# EAGLE design EmbluLjós (EAGLE 6.5.0)
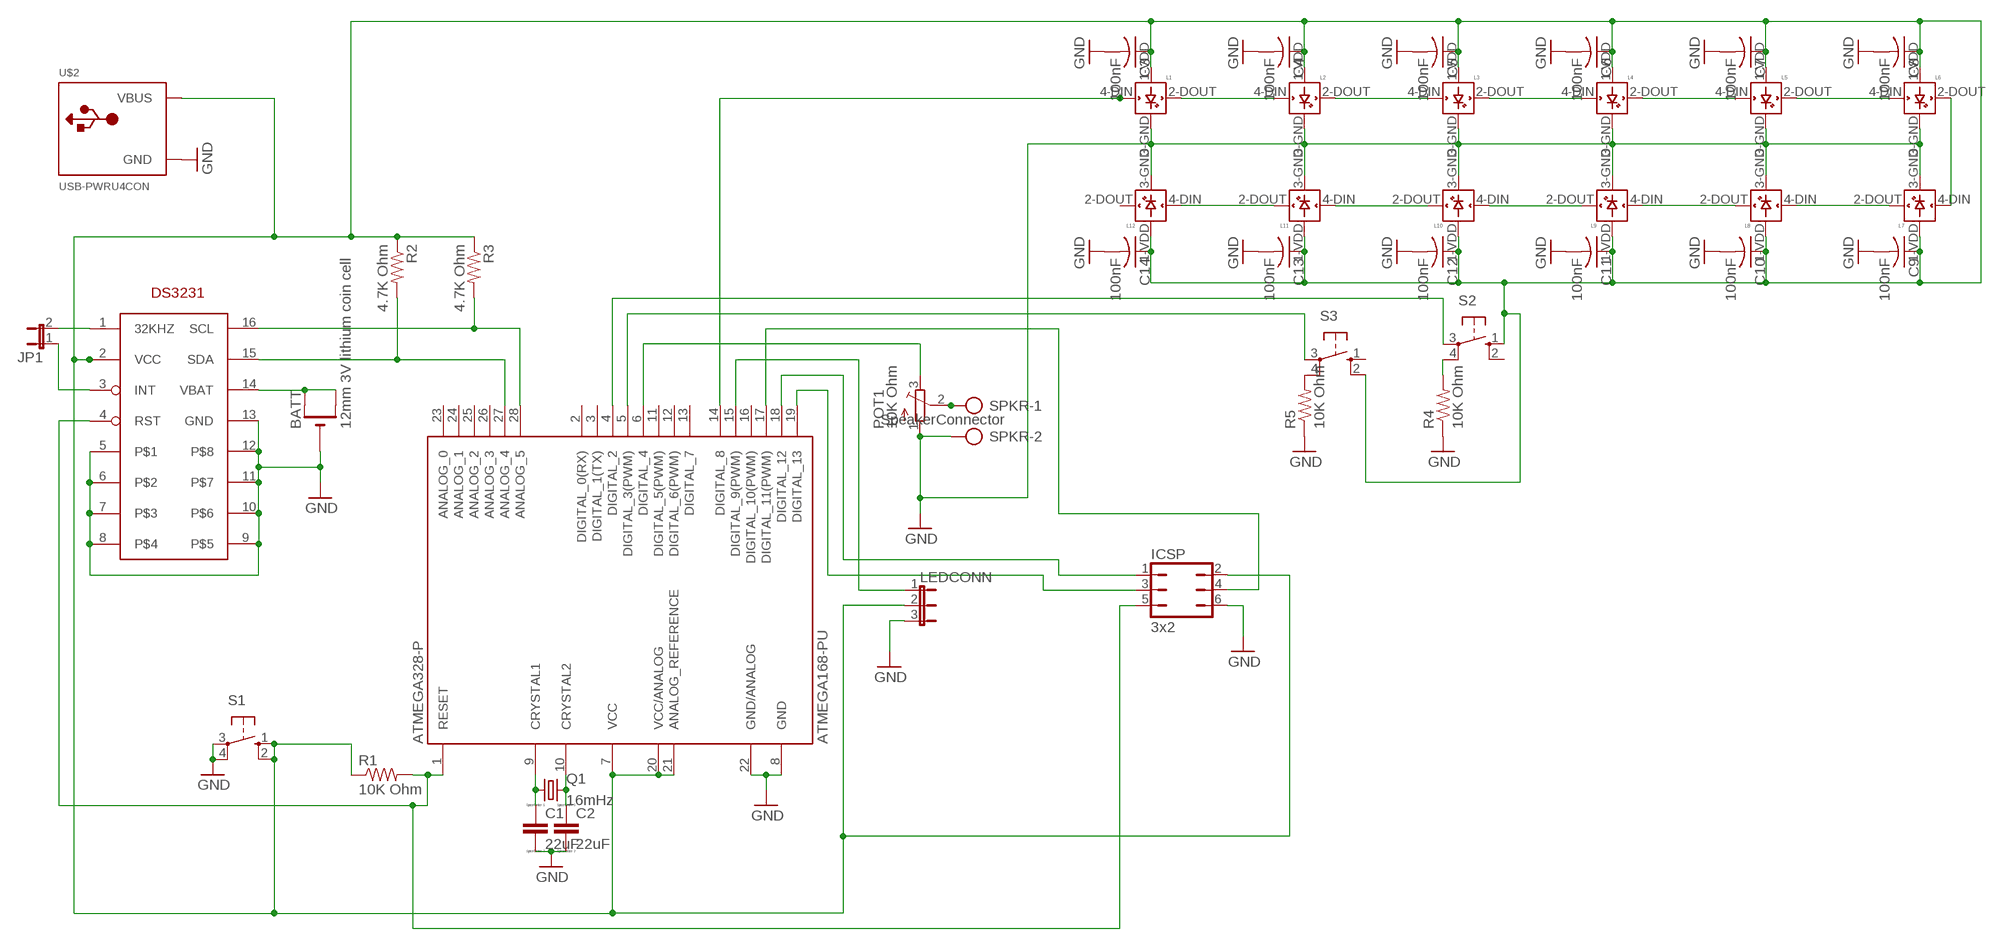
[diagram p0: schematic, sheet 1]

## Parts
ATMEGA328-P  ATMEGA168-PU  [DIL28-3]
BATT  12mm 3V lithium coin cell  CR1220THM  [CR1220-THM]
C1  22uF  C  [C0805]
C2  22uF  C  [C0805]
C3  100nF  C-USC0805  [C0805]
C4  100nF  C-USC0805  [C0805]
C5  100nF  C-USC0805  [C0805]
C6  100nF  C-USC0805  [C0805]
C7  100nF  C-USC0805  [C0805]
C8  100nF  C-USC0805  [C0805]
C9  100nF  C-USC0805  [C0805]
C10  100nF  C-USC0805  [C0805]
C11  100nF  C-USC0805  [C0805]
C12  100nF  C-USC0805  [C0805]
C13  100nF  C-USC0805  [C0805]
C14  100nF  C-USC0805  [C0805]
ICSP  3x2  JP3Q  [JP3Q]
JP1  JP1E  [JP1]
L1  WS2812B  [WS2812B]
L2  WS2812B  [WS2812B]
L3  WS2812B  [WS2812B]
L4  WS2812B  [WS2812B]
L5  WS2812B  [WS2812B]
L6  WS2812B  [WS2812B]
L7  WS2812B  [WS2812B]
L8  WS2812B  [WS2812B]
L9  WS2812B  [WS2812B]
L10  WS2812B  [WS2812B]
L11  WS2812B  [WS2812B]
L12  WS2812B  [WS2812B]
LEDCONN  JP2E  [JP2]
POT1  10K Ohm  TRIMPOTTC33X  [TC33X]
Q1  16mHz  CRYSTALHC49S  [HC49/S]
R1  10K Ohm  R-US_R0805  [R0805]
R2  4.7K Ohm  R-US_R0805  [R0805]
R3  4.7K Ohm  R-US_R0805  [R0805]
R4  10K Ohm  R-US_R0805  [R0805]
R5  10K Ohm  R-US_R0805  [R0805]
S1  10-XX  [B3F-10XX]
S2  10-XX  [B3F-10XX]
S3  10-XX  [B3F-10XX]
SPKR  SpeakerConnector  AK500/2-H  [AK500/2-H]
U$1  DS3231  [SO16]
U$2  USB-PWRU4CON  [USB-MINIB-THM-PWRONLY]

## Nets
GND: ATMEGA328-P.8(GND) ATMEGA328-P.22(GND/ANALOG) BATT.- C1.2 C2.2 C3.2 C4.2 C5.2 C6.2 C7.2 C8.2 C9.2 C10.2 C11.2 C12.2 C13.2 C14.2 ICSP.6 L1.3-GND(GND) L2.3-GND(GND) L3.3-GND(GND) L4.3-GND(GND) L5.3-GND(GND) L6.3-GND(GND) L7.3-GND(GND) L8.3-GND(GND) L9.3-GND(GND) L10.3-GND(GND) L11.3-GND(GND) L12.3-GND(GND) LEDCONN.3 POT1.1(A) R4.1 R5.1 S1.3(P) S1.4(P1) SPKR.2 U$1.5 U$1.6 U$1.7 U$1.8 U$1.9 U$1.10 U$1.11 U$1.12 U$1.13(GND) U$2.GND
N$1: ATMEGA328-P.1(RESET) ICSP.5 R1.2 U$1.4(RST)
N$2: ATMEGA328-P.18(DIGITAL_12) ICSP.1
N$3: BATT.+1(+) BATT.+2(+1) U$1.14(VBAT)
N$4: POT1.2(S) SPKR.1
N$5: ATMEGA328-P.6(DIGITAL_4) POT1.3(E)
N$6: ATMEGA328-P.28(ANALOG_5) R3.2 U$1.16(SCL)
N$7: ATMEGA328-P.27(ANALOG_4) R2.2 U$1.15(SDA)
N$8: ATMEGA328-P.10(CRYSTAL2) C2.1 Q1.2
N$9: ATMEGA328-P.9(CRYSTAL1) C1.1 Q1.1
N$10: ATMEGA328-P.15(DIGITAL_9(PWM)) LEDCONN.1
N$11: JP1.2 U$1.1(32KHZ)
N$12: JP1.1 U$1.3(INT)
N$13: L1.2-DOUT(DOUT) L2.4-DIN(DIN)
N$14: L2.2-DOUT(DOUT) L3.4-DIN(DIN)
N$15: L3.2-DOUT(DOUT) L4.4-DIN(DIN)
N$16: L4.2-DOUT(DOUT) L5.4-DIN(DIN)
N$17: L5.2-DOUT(DOUT) L6.4-DIN(DIN)
N$18: ATMEGA328-P.19(DIGITAL_13) ICSP.3
N$19: L6.2-DOUT(DOUT) L7.4-DIN(DIN)
N$20: L7.2-DOUT(DOUT) L8.4-DIN(DIN)
N$21: L8.2-DOUT(DOUT) L9.4-DIN(DIN)
N$22: L10.2-DOUT(DOUT) L11.4-DIN(DIN)
N$23: L11.2-DOUT(DOUT) L12.4-DIN(DIN)
N$24: L9.2-DOUT(DOUT) L10.4-DIN(DIN)
N$25: ATMEGA328-P.4(DIGITAL_2) S2.3(P)
N$26: R4.2 S2.4(P1)
N$27: ATMEGA328-P.7(VCC) ATMEGA328-P.20(VCC/ANALOG) ATMEGA328-P.21(ANALOG_REFERENCE) C3.1 C4.1 C5.1 C6.1 C7.1 C8.1 C9.1 C10.1 C11.1 C12.1 C13.1 C14.1 ICSP.2 L1.1-VDD(VDD) L2.1-VDD(VDD) L3.1-VDD(VDD) L4.1-VDD(VDD) L5.1-VDD(VDD) L6.1-VDD(VDD) L7.1-VDD(VDD) L8.1-VDD(VDD) L9.1-VDD(VDD) L10.1-VDD(VDD) L11.1-VDD(VDD) L12.1-VDD(VDD) LEDCONN.2 R1.1 R2.1 R3.1 S1.1(S) S1.2(S1) S2.1(S) S3.2(S1) U$1.2(VCC) U$2.VBUS
N$28: R5.2 S3.4(P1)
N$29: ATMEGA328-P.5(DIGITAL_3(PWM)) S3.3(P)
N$38: ATMEGA328-P.14(DIGITAL_8) L1.4-DIN(DIN)
N$39: ATMEGA328-P.17(DIGITAL_11(PWM)) ICSP.4
Unconnected: ATMEGA328-P.2(DIGITAL_0(RX)) ATMEGA328-P.3(DIGITAL_1(TX)) ATMEGA328-P.11(DIGITAL_5(PWM)) ATMEGA328-P.12(DIGITAL_6(PWM)) ATMEGA328-P.13(DIGITAL_7) ATMEGA328-P.16(DIGITAL_10(PWM)) ATMEGA328-P.23(ANALOG_0) ATMEGA328-P.24(ANALOG_1) ATMEGA328-P.25(ANALOG_2) ATMEGA328-P.26(ANALOG_3) L12.2-DOUT(DOUT) S2.2(S1) S3.1(S)

## Library data of the parts
ATMEGA328-P = Arduino-AVR:ATMEGA168-PU
BATT = adafruit:CR1220: CR1216/CR1220/CR1225 12mm 3V lithium coin cell Great for battery packup. Both SMT and THM holders. Note the THM package has the ground pads on both sides of the PCB so that the masks are the same - this reduces the cost
C1 C2 = eagle-ltspice:C: CAPACITOR, European symbol; SPICEMODEL: NONE; SPICEPREFIX: C
C3-C14 = adafruit:C-US: CAPACITOR, American symbol
ICSP = jumper:JP3Q: JUMPER
JP1 = jumper:JP1E: JUMPER
L1-L12 = adafruit:WS2812B
LEDCONN = jumper:JP2E: JUMPER
POT1 = adafruit:TRIMPOT: SMT trimmer potentiometer part number TC33X http://www.ladyada.net/library/eagle
Q1 = crystal:CRYSTAL: CRYSTAL; OC_FARNELL: 1667008; OC_NEWARK: unknown
R1-R5 = rcl:R-US_: RESISTOR, American symbol
S1-S3 = switch-omron:10-XX: OMRON SWITCH; MPN: B3F-1000; OC_FARNELL: 176432; OC_NEWARK: 36M3542
SPKR = con-ptr500:AK500/2-H: CONNECTOR Aug. 2004 / PTR Meßtechnik: Die Bezeichnung der Serie AK505 wurde geändert. Es handelt sich hierbei um AK500 in horizontaler Ausführung.; OC_FARNELL: unknown; OC_NEWARK: unknown
U$1 = DS3231:DS3231
U$2 = adafruit:USB-PWR

## Board
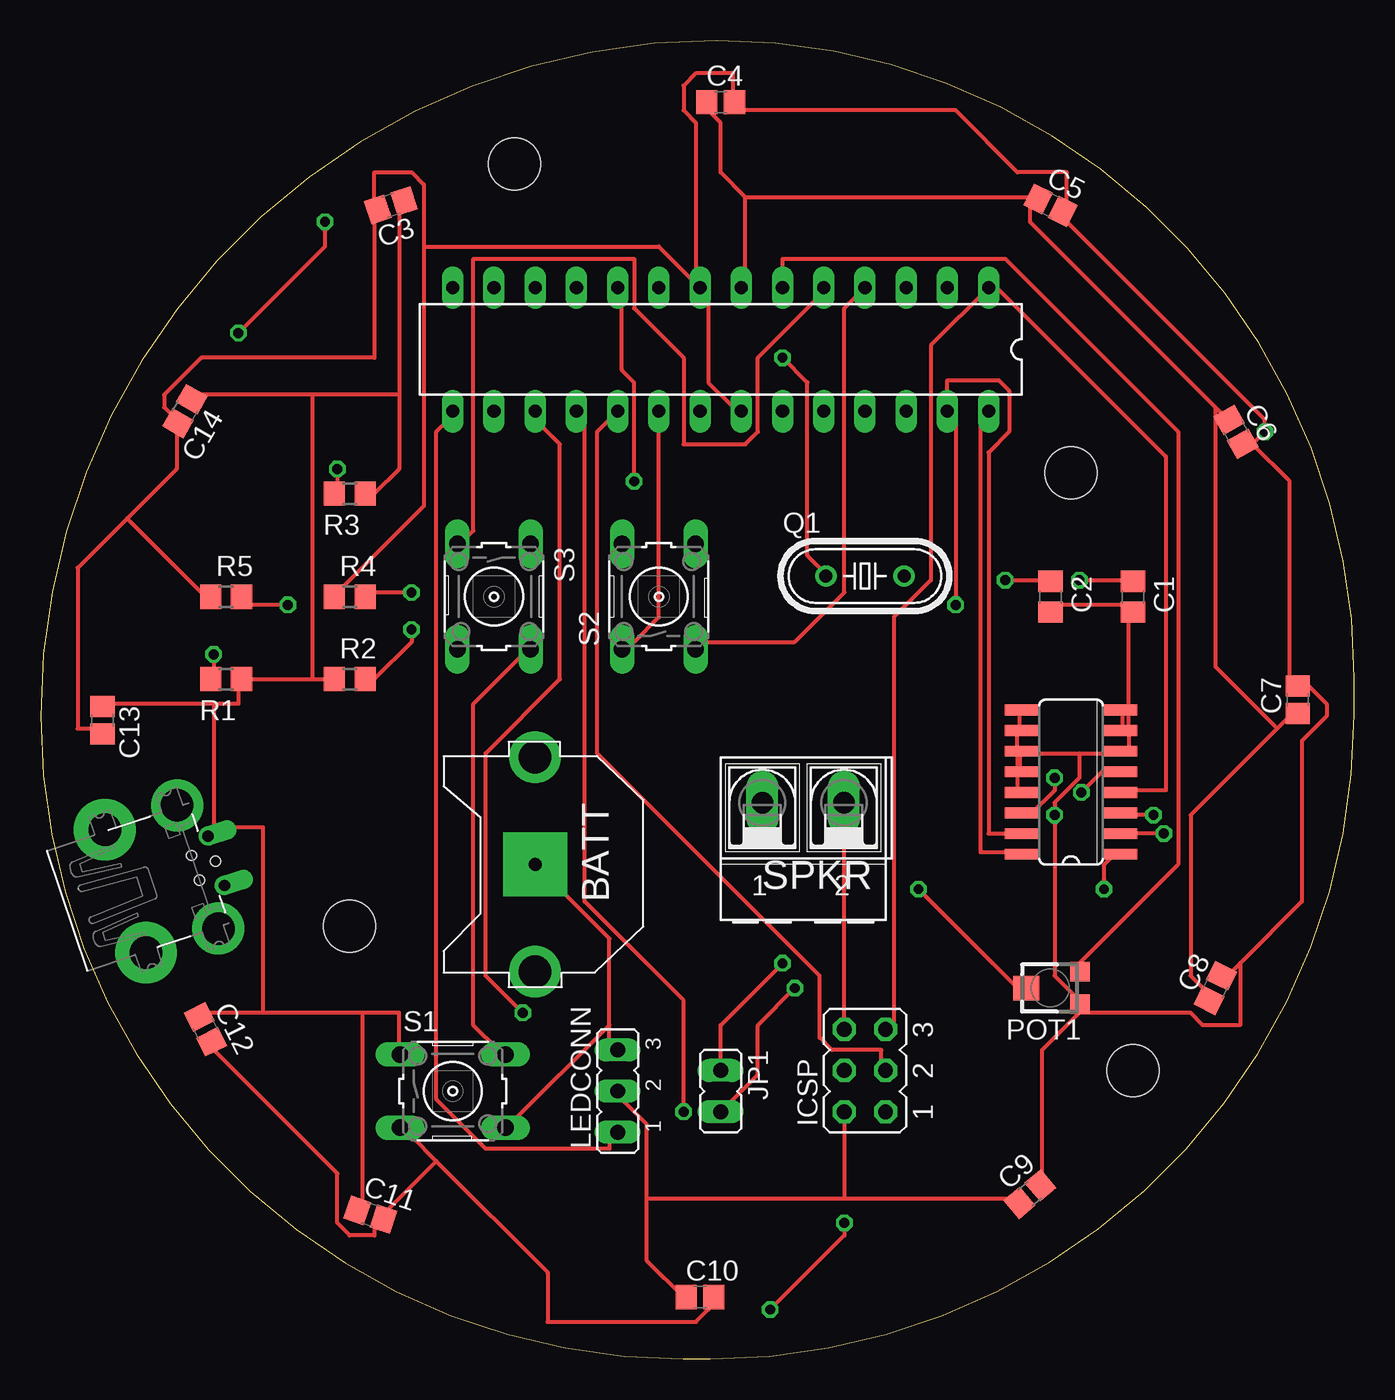
[diagram p1: board, top side]
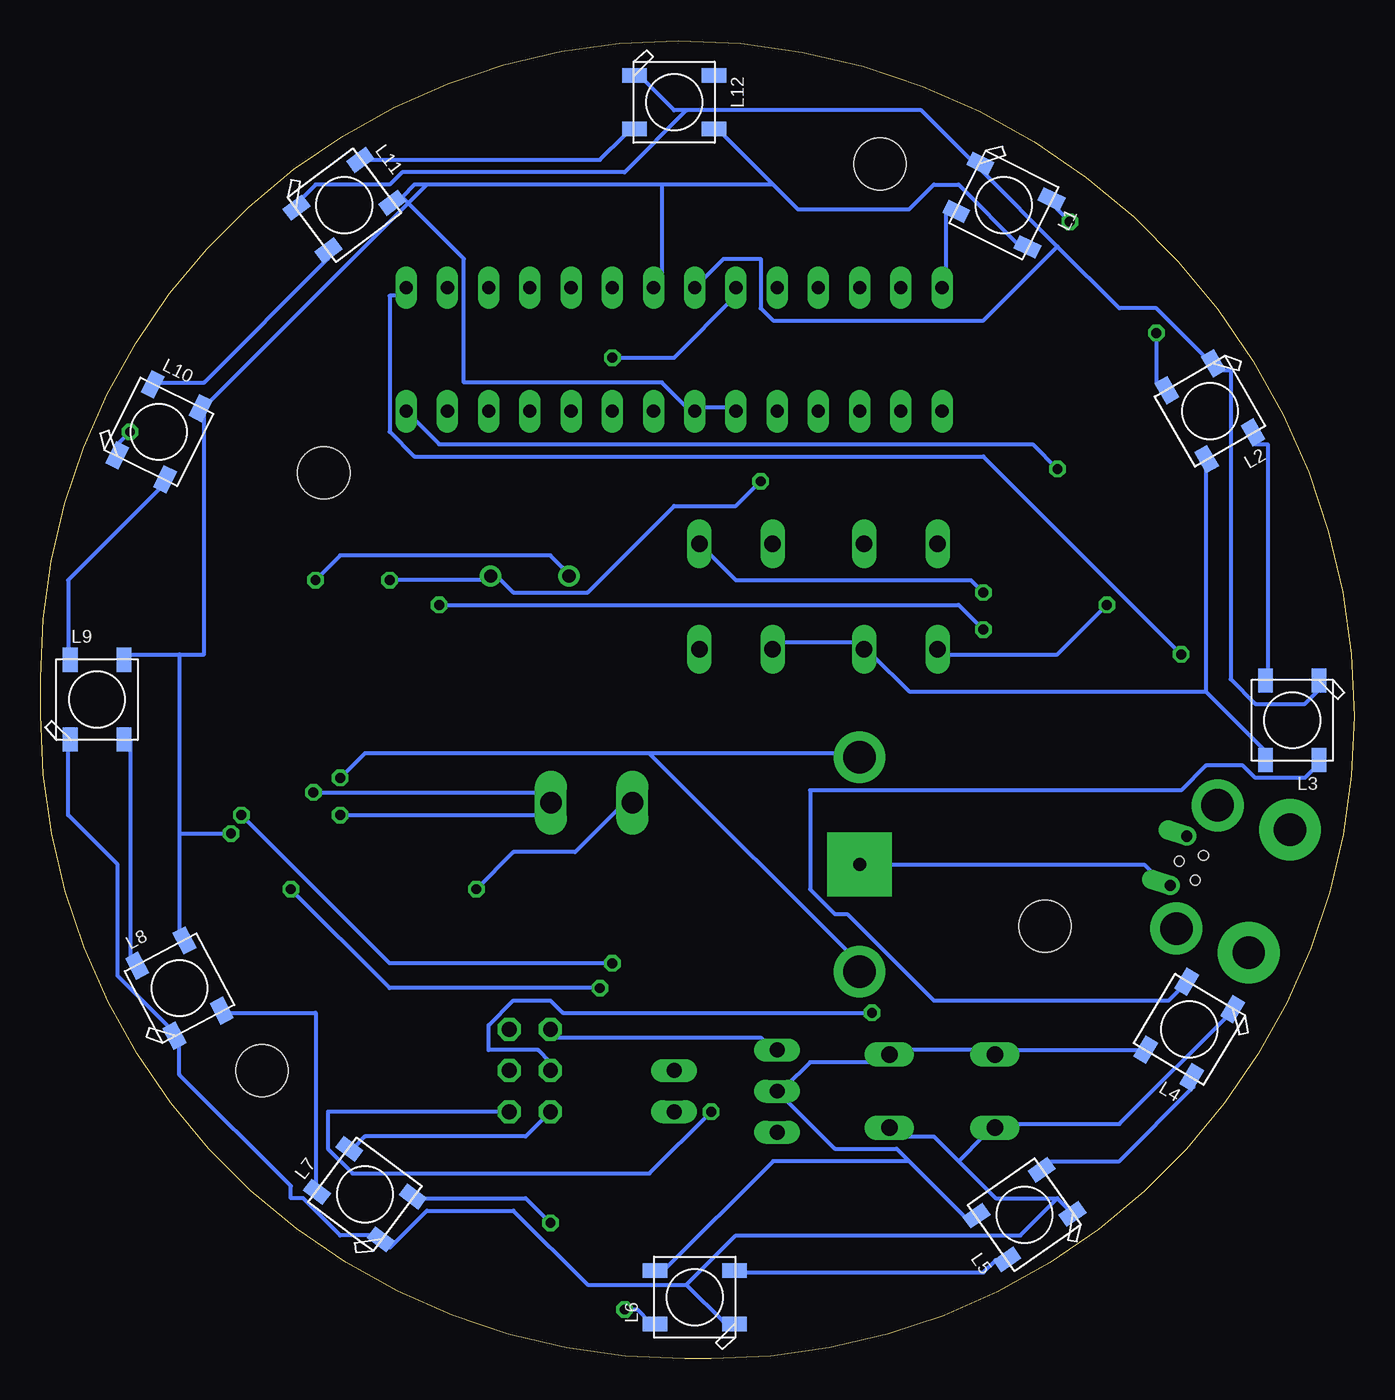
[diagram p2: board, bottom side, seen from below]

Size 80.95 x 81.27 mm. Coordinates in mm from the lower left corner, seen from the top.
Outline: 0,39.62 arc90 39.62,0 41.26,0 arc90 80.95,39.69 80.95,41.97 arc90 41.65,81.27 arc90 0,39.62
Copper layers (1*16): Top 0.035mm / dielectric 1.5mm / Bottom 0.035mm
Design rules "default": minimum track width 10mil, minimum drill 24mil, track to track 8mil, track to pad 8mil, pad to pad 8mil, via to via 8mil, smd to smd 8mil, copper to edge 40mil, drill to drill 8mil, minimum pad ring 10mil, minimum via ring 8mil, stop-mask expansion 4mil, vias tented up to drill 0mil, thermal gap 10mil
Holes 3.2 mm at 19.05,26.67 29.21,73.66 63.5,54.61 67.31,17.78

### Footprints (pad centres in the part's own frame; a part is rotated, then mirrored left to right if it is on the bottom)
DIL28-3 = drill 0.813 long: 1 -16.51,-3.81; 2 -13.97,-3.81; 3 -11.43,-3.81; 4 -8.89,-3.81; 5 -6.35,-3.81; 6 -3.81,-3.81; 7 -1.27,-3.81; 8 1.27,-3.81; 9 3.81,-3.81; 10 6.35,-3.81; 11 8.89,-3.81; 12 11.43,-3.81; 13 13.97,-3.81; 14 16.51,-3.81; 15 16.51,3.81; 16 13.97,3.81; 17 11.43,3.81; 18 8.89,3.81; 19 6.35,3.81; 20 3.81,3.81; 21 1.27,3.81; 22 -1.27,3.81; 23 -3.81,3.81; 24 -6.35,3.81; 25 -8.89,3.81; 26 -11.43,3.81; 27 -13.97,3.81; 28 -16.51,3.81
CR1220-THM = drill 2 pad 3.175: +1 -6.604,0; +2 6.604,0 | drill 0.8 pad 3.962 square: - 0,0
C0805 = smd 1.3 x 1.5: 1 -0.95,0; 2 0.95,0
C0805' = smd 1.3 x 1.5: 1 -0.85,0; 2 0.85,0
JP3Q = drill 0.914 octagon: 1 -2.54,-1.27; 2 -2.54,1.27; 3 0,-1.27; 4 0,1.27; 5 2.54,-1.27; 6 2.54,1.27
JP1 = drill 0.914 long: 1 0,-1.27; 2 0,1.27
WS2812B = smd 1.5 x 0.9: 1-VDD 2.45,-1.65; 2-DOUT 2.45,1.65; 3-GND -2.45,1.65; 4-DIN -2.45,-1.65
JP2 = drill 0.914 long: 1 -2.54,0; 2 0,0; 3 2.54,0
TC33X = smd 1.2 x 1.2: 1 -1,-1.825; 3 1,-1.825 | smd 1.5 x 1.6: 2 0,1.5
HC49/S = drill 0.813: 1 -2.413,0; 2 2.413,0
R0805 = smd 1.3 x 1.5: 1 -0.95,0; 2 0.95,0
B3F-10XX = drill 1.016 long: 1 -3.251,2.261; 2 3.251,2.261; 3 -3.251,-2.261; 4 3.251,-2.261
AK500/2-H = drill 1.321 long: 1 -2.515,0; 2 2.515,0
SO16 = smd 0.66 x 2.032: 1 -4.445,-3.073; 2 -3.175,-3.073; 3 -1.905,-3.073; 4 -0.635,-3.073; 5 0.635,-3.073; 6 1.905,-3.073; 7 3.175,-3.073; 8 4.445,-3.073; 9 4.445,3.073; 10 3.175,3.073; 11 1.905,3.073; 12 0.635,3.073; 13 -0.635,3.073; 14 -1.905,3.073; 15 -3.175,3.073; 16 -4.445,3.073
USB-MINIB-THM-PWRONLY = drill 0.7 offset: GND 1.6,4.72; VBUS -1.6,4.72 | drill 2 pad 3.81: GND1 -4,-1.18; GND4 4,-1.18 | drill 2 pad 3.2: GND2 -4,3.52; GND3 4,3.52 | hole 0.6: -0.8,3.37; 0.8,3.37; 0,4.67

### Placement (x,y rotation side)
ATMEGA328-P  41.91,62.23 180 top
BATT  30.48,30.48 90 top
C1  67.31,46.99 270 top
C2  62.23,46.99 270 top
C3  100nF  [C0805']  21.59,71.12 198.5 top
C4  100nF  [C0805']  41.91,77.47 0 top
C5  100nF  [C0805']  62.23,71.12 333.5 top
C6  100nF  [C0805']  73.66,57.15 299.7 top
C7  100nF  [C0805']  77.47,40.64 90 top
C8  100nF  [C0805']  72.39,22.86 63.5 top
C9  100nF  [C0805']  60.96,10.16 40 top
C10  100nF  [C0805']  40.64,3.81 0 top
C11  100nF  [C0805']  20.32,8.89 341.5 top
C12  100nF  [C0805']  10.16,20.32 296.5 top
C13  100nF  [C0805']  3.81,39.37 270 top
C14  100nF  [C0805']  8.89,58.42 240 top
ICSP  50.8,17.78 90 top
JP1  41.91,16.51 180 top
L1  21.59,71.12 333.5 bottom
L2  8.89,58.42 300 bottom
L3  3.81,39.37 270 bottom
L4  10.16,20.32 239.1 bottom
L5  20.32,8.89 215 bottom
L6  40.64,3.81 180 bottom
L7  60.96,10.16 143.2 bottom
L8  72.39,22.86 117.9 bottom
L9  77.47,40.64 90 bottom
L10  73.66,57.15 63.5 bottom
L11  62.23,71.12 36.8 bottom
L12  41.91,77.47 0 bottom
LEDCONN  35.56,16.51 90 top
POT1  62.23,22.86 90 top
Q1  50.8,48.26 0 top
R1  11.43,41.91 180 top
R2  19.05,41.91 0 top
R3  19.05,53.34 180 top
R4  19.05,46.99 0 top
R5  11.43,46.99 0 top
S1  25.4,16.51 0 top
S2  38.1,46.99 90 top
S3  27.94,46.99 270 top
SPKR  46.99,34.29 0 top
U$1  63.5,35.56 90 top
U$2  6.35,29.21 288.5 top

### Tracks (layer width: path | path; a pad name or v marks a point on that pad's centre or on a via)
GND  (via drill 0.61)
  Top 0.254: C12.2 10.67,19.05 18.29,11.43 18.29,8.38 19.05,7.62 20.57,7.62 20.57,8.38 C11.2 21.34,9.14 24.38,12.19 | 24.38,12.19 22.86,13.72 S1.3 | 24.38,12.19 31.24,5.33 31.24,2.29 40.39,2.29 41.15,3.05 41.15,3.81 C10.2 | 11.43,28.96 U$2.GND | ICSP.6 49.53,34.29 SPKR.2 | BATT.- 35.05,25.91 35.05,20.57 | 35.05,20.57 35.05,19.05 LEDCONN.3 | 35.05,20.57 28.96,14.48 S1.4 | 5.33,51.82 8.38,54.86 8.38,57.15 C14.2 8.38,57.91 7.62,58.67 7.62,59.44 9.91,61.72 20.57,61.72 20.57,70.1 C3.2 20.57,70.87 20.57,73.15 22.86,73.15 23.62,72.39 23.62,68.58 | 5.33,51.82 2.29,48.77 2.29,38.86 3.81,38.86 C13.2 | 5.33,51.82 9.91,47.24 R5.1 | ATMEGA328-P.22 42.67,58.67 41.15,60.2 41.15,65.53 ATMEGA328-P.8 40.39,66.29 | 23.62,68.58 23.62,52.58 18.29,47.24 R4.1 | 40.39,66.29 38.1,68.58 23.62,68.58 | 64.01,21.34 61.72,19.05 61.72,11.43 C9.2 | C2.2 62.48,46.48 67.06,46.48 C1.2 67.06,45.72 67.06,38.86 | 67.06,38.86 67.06,37.34 U$1.6 66.29,37.34 64.01,37.34 | 60.2,37.34 60.2,35.05 U$1.13 | 60.2,37.34 60.2,38.86 U$1.10 60.33,38.73 60.33,40.01 U$1.9 | 60.2,37.34 U$1.11 | 64.01,37.34 60.96,37.34 U$1.11 | 67.06,38.86 U$1.7 66.67,38.73 66.67,40.01 U$1.8 | 64.01,37.34 64.01,35.81 62.48,34.29 v62.48,33.53 62.48,23.62 64.01,22.1 POT1.1 64.01,21.34 | 73.91,24.38 77.72,28.19 77.72,38.1 79.25,39.62 79.25,40.39 77.72,41.91 C7.2 76.96,41.91 76.96,54.1 74.68,56.39 | 73.91,24.38 73.15,23.62 C8.2 | 74.68,56.39 v75.44,57.15 75.44,57.91 63.25,70.1 C5.2 63.25,70.87 63.25,73.15 60.2,73.15 56.39,76.96 42.67,76.96 C4.2 42.67,77.72 42.67,79.25 40.39,79.25 39.62,78.49 39.62,76.96 40.39,76.2 40.39,66.29 | 74.68,56.39 C6.2
  Top 0.254: 64.01,21.34 70.87,21.34 71.63,20.57 73.91,20.57 73.91,24.38 | U$1.12 60.33,36.2 60.33,37.47 U$1.11 | v64.14,34.92 65.41,36.2 U$1.5
  Bottom 0.254: 18.29,9.91 17.53,9.14 L5.3-GND | 18.29,9.91 22.1,9.91 24.38,12.19 | 24.38,12.19 25.91,13.72 28.19,13.72 S1.4 | L4.3-GND 7.62,21.34 14.48,14.48 22.1,14.48 S1.3 22.86,13.72 24.38,12.19 | BATT.- 12.95,30.48 11.43,28.96 U$2.GND | LEDCONN.3 35.81,19.05 36.58,19.81 49.53,19.81 ICSP.6 | 41.15,4.57 38.86,2.29 L6.3-GND | 41.15,4.57 47.24,4.57 51.82,9.14 57.15,9.14 59.44,6.86 L7.3-GND 60.2,7.62 62.48,7.62 64.77,9.91 65.53,9.91 65.53,10.67 72.39,17.53 72.39,19.81 | 72.39,19.81 76.2,23.62 76.2,30.48 79.25,33.53 79.25,38.1 L9.3-GND | 72.39,19.81 L8.3-GND | 18.29,9.91 20.57,7.62 38.1,7.62 41.15,4.57 | L3.3-GND 2.29,41.15 3.05,40.39 6.1,40.39 7.62,41.91 7.62,60.96 8.38,60.96 L2.3-GND 9.14,61.72 12.19,64.77 14.48,64.77 18.29,68.58 | 18.29,68.58 22.86,73.15 L1.3-GND 23.62,73.91 26.67,76.96 41.15,76.96 | 41.15,76.96 41.91,76.96 44.2,79.25 L12.3-GND | 41.15,76.96 44.96,73.15 58.67,73.15 59.44,72.39 64.01,72.39 64.77,71.63 L11.3-GND | v75.44,57.15 76.2,56.39 L10.3-GND | 18.29,68.58 22.86,64.01 35.81,64.01 36.58,64.77 36.58,67.82 38.86,67.82 ATMEGA328-P.8 | 49.53,34.29 50.29,33.53 v62.48,33.53 | 49.53,34.29 50.16,34.92 v64.14,34.92 | 49.53,34.29 SPKR.2
N$1  (via drill 0.61)
  Top 0.254: v10.67,43.43 10.67,41.91 R1.2 | U$1.4 67.06,35.05 69.34,35.05 69.34,55.63 58.67,66.29 ATMEGA328-P.1 54.86,62.48 54.86,48.01 52.58,45.72 52.58,20.57 ICSP.5
  Bottom 0.254: v10.67,43.43 22.86,55.63 57.91,55.63 59.44,57.15 59.44,65.53 58.67,65.53 ATMEGA328-P.1
N$2  (via drill 0.61)
  Top 0.254: v39.62,15.24 39.62,22.1 33.53,28.19 33.53,57.91 ATMEGA328-P.18
  Bottom 0.254: v39.62,15.24 43.43,11.43 61.72,11.43 63.25,12.95 63.25,15.24 ICSP.1
N$3  (via drill 0.61)
  Top 0.254: v62.48,35.81 62.48,35.05 60.96,33.53 U$1.14
  Bottom 0.254: v62.48,35.81 60.96,37.34 43.43,37.34 | 43.43,37.34 30.48,37.34 BATT.+2 | 43.43,37.34 30.48,24.38 BATT.+1
N$4  (via drill 0.61)
  Top 0.254: v54.1,28.96 60.2,22.86 POT1.2
  Bottom 0.254: v54.1,28.96 51.82,31.24 48.01,31.24 44.96,34.29 SPKR.1
N$5
  Top 0.254: ATMEGA328-P.6 45.72,67.82 59.44,67.82 70.1,57.15 70.1,30.48 64.01,24.38 POT1.3
N$6  (via drill 0.61)
  Top 0.254: v18.29,54.86 18.29,53.34 R3.2 | U$1.16 60.2,31.24 57.91,31.24 57.91,57.91 ATMEGA328-P.28
  Bottom 0.254: v18.29,54.86 19.81,56.39 56.39,56.39 ATMEGA328-P.28
N$7  (via drill 0.61)
  Top 0.254: v22.86,44.96 22.86,44.2 20.57,41.91 R2.2 | v56.39,46.48 56.39,57.91 ATMEGA328-P.27 55.88,60.33 59.05,60.33 59.69,59.69 59.69,57.15 58.42,55.88 58.42,32.38 U$1.15
  Bottom 0.254: v22.86,44.96 24.38,46.48 v56.39,46.48
N$8  (via drill 0.61)
  Top 0.254: v59.44,48.01 61.72,48.01 C2.1 | v36.58,54.1 36.58,60.2 35.81,60.96 35.81,65.53 ATMEGA328-P.10
  Bottom 0.254: v59.44,48.01 53.34,48.01 Q1.2 52.58,48.01 51.82,47.24 47.24,47.24 41.91,52.58 38.1,52.58 v36.58,54.1
N$9  (via drill 0.61)
  Top 0.254: v64.01,48.01 67.06,48.01 C1.1 | v45.72,61.72 47.24,60.2 47.24,49.53 48.01,48.77 Q1.1
  Bottom 0.254: v64.01,48.01 62.48,49.53 49.53,49.53 48.77,48.77 Q1.1 | v45.72,61.72 41.91,61.72 38.1,65.53 ATMEGA328-P.9
N$10
  Top 0.254: ATMEGA328-P.15 25.15,57.91 24.38,57.15 24.38,16 27.43,12.95 35.05,12.95 35.05,13.72 LEDCONN.1
N$11  (via drill 0.61)
  Top 0.254: v65.53,28.96 65.53,30.48 66.29,31.24 U$1.1 | v46.48,22.86 44.2,20.57 44.2,17.53 JP1.2
  Bottom 0.254: v65.53,28.96 59.44,22.86 v46.48,22.86
N$12  (via drill 0.61)
  Top 0.254: v68.58,33.53 67.06,33.53 U$1.3 | v45.72,24.38 41.91,20.57 JP1.1
  Bottom 0.254: v68.58,33.53 59.44,24.38 v45.72,24.38
N$13  (via drill 0.61)
  Top 0.254: v12.19,63.25 17.53,68.58 v17.53,70.1
  Bottom 0.254: v12.19,63.25 12.19,60.2 L2.4-DIN | v17.53,70.1 18.29,70.87 L1.2-DOUT
N$14
  Bottom 0.254: L3.4-DIN 5.33,41.91 5.33,56.39 6.1,56.39 L2.2-DOUT
N$15
  Bottom 0.254: L4.4-DIN 10.67,22.86 11.43,22.1 25.91,22.1 31.24,27.43 32,27.43 33.53,28.96 33.53,35.05 10.67,35.05 9.14,36.58 6.86,36.58 6.1,35.81 3.05,35.81 2.29,36.58 L3.2-DOUT
N$16
  Bottom 0.254: L4.2-DOUT 9.91,16.76 14.48,12.19 19.05,12.19 L5.4-DIN
N$17
  Bottom 0.254: L5.2-DOUT 22.1,6.1 22.86,5.33 38.1,5.33 L6.4-DIN
N$18
  Top 0.254: ATMEGA328-P.19 34.29,57.15 34.29,37.34 48.01,23.62 48.01,19.81 48.77,19.05 51.82,19.05 51.82,18.29 ICSP.3
N$19  (via drill 0.61)
  Top 0.254: v44.96,3.05 49.53,7.62 v49.53,8.38
  Bottom 0.254: v44.96,3.05 44.2,3.05 43.43,2.29 L6.2-DOUT | v49.53,8.38 51.05,9.91 57.91,9.91 L7.4-DIN
N$20
  Bottom 0.254: L7.2-DOUT 64.01,10.67 64.01,21.34 69.34,21.34 L8.4-DIN
N$21
  Bottom 0.254: L8.2-DOUT 75.44,24.38 75.44,38.1 L9.4-DIN
N$22
  Bottom 0.254: L11.4-DIN 63.25,67.82 70.87,60.2 73.91,60.2 L10.2-DOUT
N$23
  Bottom 0.254: L12.4-DIN 44.96,75.44 46.48,73.91 60.96,73.91 L11.2-DOUT
N$24
  Bottom 0.254: L9.2-DOUT 79.25,43.43 79.25,48.01 73.15,54.1 L10.4-DIN
N$25
  Top 0.254: ATMEGA328-P.4 49.53,64.77 49.53,47.24 46.48,44.2 40.39,44.2 S2.3
N$26  (via drill 0.61)
  Top 0.254: v22.86,47.24 20.57,47.24 R4.2
  Bottom 0.254: v22.86,47.24 23.62,48.01 38.1,48.01 39.62,49.53 S2.4
N$27  (via drill 0.61)
  Top 0.254: 76.2,38.86 76.96,39.62 C7.1 | 76.2,38.86 70.87,33.53 70.87,23.62 71.63,22.86 C8.1 | 43.43,71.63 60.96,71.63 | 43.43,71.63 43.43,66.29 ATMEGA328-P.7 | 43.43,71.63 41.91,73.15 41.91,76.2 41.15,76.96 C4.1 | 72.39,58.67 60.96,70.1 60.96,71.63 | 72.39,58.67 73.15,57.91 C6.1 | 60.96,71.63 C5.1 | 76.2,38.86 72.39,42.67 72.39,58.67 | ATMEGA328-P.20 38.1,45.72 36.58,44.2 S2.1 | 49.53,9.91 60.2,9.91 C9.1 | ICSP.2 49.53,9.91 | 37.34,9.91 37.34,14.48 35.81,16 LEDCONN.2 | 37.34,9.91 37.34,6.1 39.62,3.81 C10.1 | 37.34,9.91 49.53,9.91 | 22.1,59.44 22.1,70.87 C3.1 | 22.1,59.44 22.1,54.86 20.57,53.34 R3.1 | 22.1,59.44 16.76,59.44 | 16.76,59.44 9.91,59.44 C14.1 | 10.67,40.39 12.19,40.39 12.19,41.91 R1.1 16.76,41.91 | 10.67,40.39 3.81,40.39 C13.1 | 16.76,41.91 R2.1 | 10.67,40.39 10.67,32.77 | 19.81,21.34 22.1,21.34 22.1,19.05 S1.1 | 19.81,21.34 13.72,21.34 | 13.72,21.34 9.91,21.34 C12.1 | 19.81,21.34 19.81,9.14 C11.1 | 10.67,32.77 13.72,32.77 13.72,21.34 | 10.67,32.77 U$2.VBUS | 16.76,41.91 16.76,59.44 | S3.2 29.72,43.43 26.67,40.39 26.67,20.57 28.19,19.05 S1.2 | v69.22,32.38 U$1.2
  Bottom 0.254: 70.87,58.67 70.87,43.43 72.39,43.43 | 72.39,43.43 75.44,43.43 L9.1-VDD | 72.39,43.43 72.39,32.38 | 72.39,32.38 72.39,25.91 L8.1-VDD | 35.81,72.39 38.86,75.44 L12.1-VDD | 35.81,72.39 34.29,70.87 27.43,70.87 25.91,72.39 24.38,72.39 20.57,68.58 L1.1-VDD | 58.67,71.63 57.91,72.39 57.15,72.39 | 35.81,72.39 42.67,72.39 | 42.67,72.39 57.15,72.39 | 57.15,72.39 70.87,58.67 | 70.87,58.67 L10.1-VDD | 42.67,72.39 42.67,66.29 ATMEGA328-P.7 | 9.14,41.15 5.33,37.34 L3.1-VDD | 9.14,41.15 9.14,54.86 L2.1-VDD | ATMEGA328-P.20 38.1,58.67 40.39,58.67 ATMEGA328-P.21 41.15,58.67 42.67,60.2 54.86,60.2 54.86,67.82 58.67,71.63 | S2.1 35.81,44.2 30.48,44.2 S3.2 29.72,43.43 27.43,41.15 9.14,41.15 | ICSP.2 51.05,13.72 60.96,13.72 61.72,12.95 L7.1-VDD | 27.43,12.19 28.19,12.95 32,12.95 LEDCONN.2 35.05,16.76 33.53,18.29 28.96,18.29 S1.2 28.19,19.05 22.86,19.05 S1.1 22.1,19.05 12.95,19.05 L4.1-VDD | 27.43,12.19 23.62,8.38 L5.1-VDD | 27.43,12.19 35.81,12.19 42.67,5.33 L6.1-VDD | 58.67,71.63 L11.1-VDD | 72.39,32.38 v69.22,32.38
N$28  (via drill 0.61)
  Top 0.254: v15.24,46.48 12.95,46.48 R5.2
  Bottom 0.254: v15.24,46.48 18.29,43.43 25.15,43.43 S3.4
N$29
  Top 0.254: ATMEGA328-P.5 48.01,65.53 44.2,61.72 44.2,57.15 43.43,56.39 39.62,56.39 39.62,61.72 36.58,64.77 36.58,67.82 26.67,67.82 26.67,51.05 25.91,50.29 S3.3
N$38
  Bottom 0.254: L1.4-DIN 25.15,70.87 25.15,66.29 ATMEGA328-P.14
N$39  (via drill 0.61)
  Top 0.254: v29.72,21.34 27.43,23.62 27.43,37.34 32,41.91 32,56.39 30.48,57.91 ATMEGA328-P.17
  Bottom 0.254: v29.72,21.34 48.77,21.34 49.53,22.1 51.82,22.1 53.34,20.57 53.34,19.05 50.29,19.05 49.53,18.29 ICSP.4